# Altium schematic sheet Sheet2.SchDoc
size A4; SheetNumber: 3; SheetTotal: 3
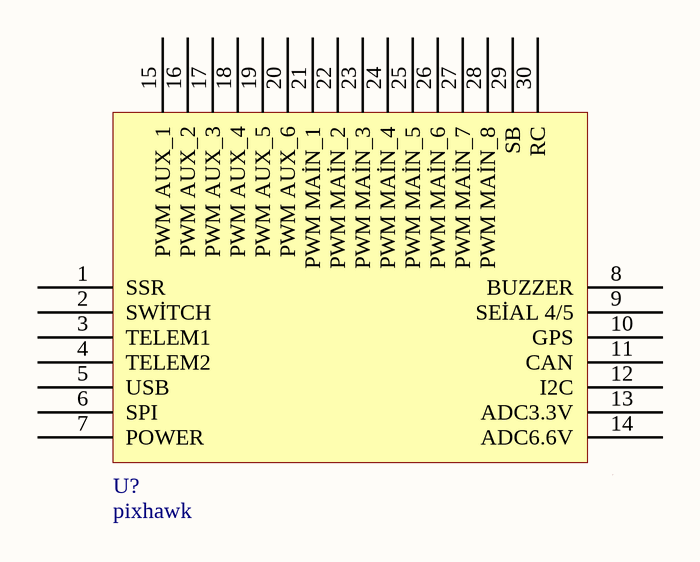
[diagram p0: Sheet2.SchDoc]

## Parts
U?  pixhawk

## Nets

Not connected (* = marked no-connect by the designer): U? 1(SSR) 2(SWİTCH) 3(TELEM1) 4(TELEM2) 5(USB) 6(SPI) 7(POWER) 8(BUZZER) 9(SEİAL_4/5) 10(GPS) 11(CAN) 12(I2C) 13(ADC3.3V) 14(ADC6.6V) 15(PWM_AUX_1) 16(PWM_AUX_2) 17(PWM_AUX_3) 18(PWM_AUX_4) 19(PWM_AUX_5) 20(PWM_AUX_6) 21(PWM_MAİN_1) 22(PWM_MAİN_2) 23(PWM_MAİN_3) 24(PWM_MAİN_4) 25(PWM_MAİN_5) 26(PWM_MAİN_6) 27(PWM_MAİN_7) 28(PWM_MAİN_8) 29(SB) 30(RC)